# EAGLE design core1 (EAGLE 6.6.0)

## Sheet 1 of 2
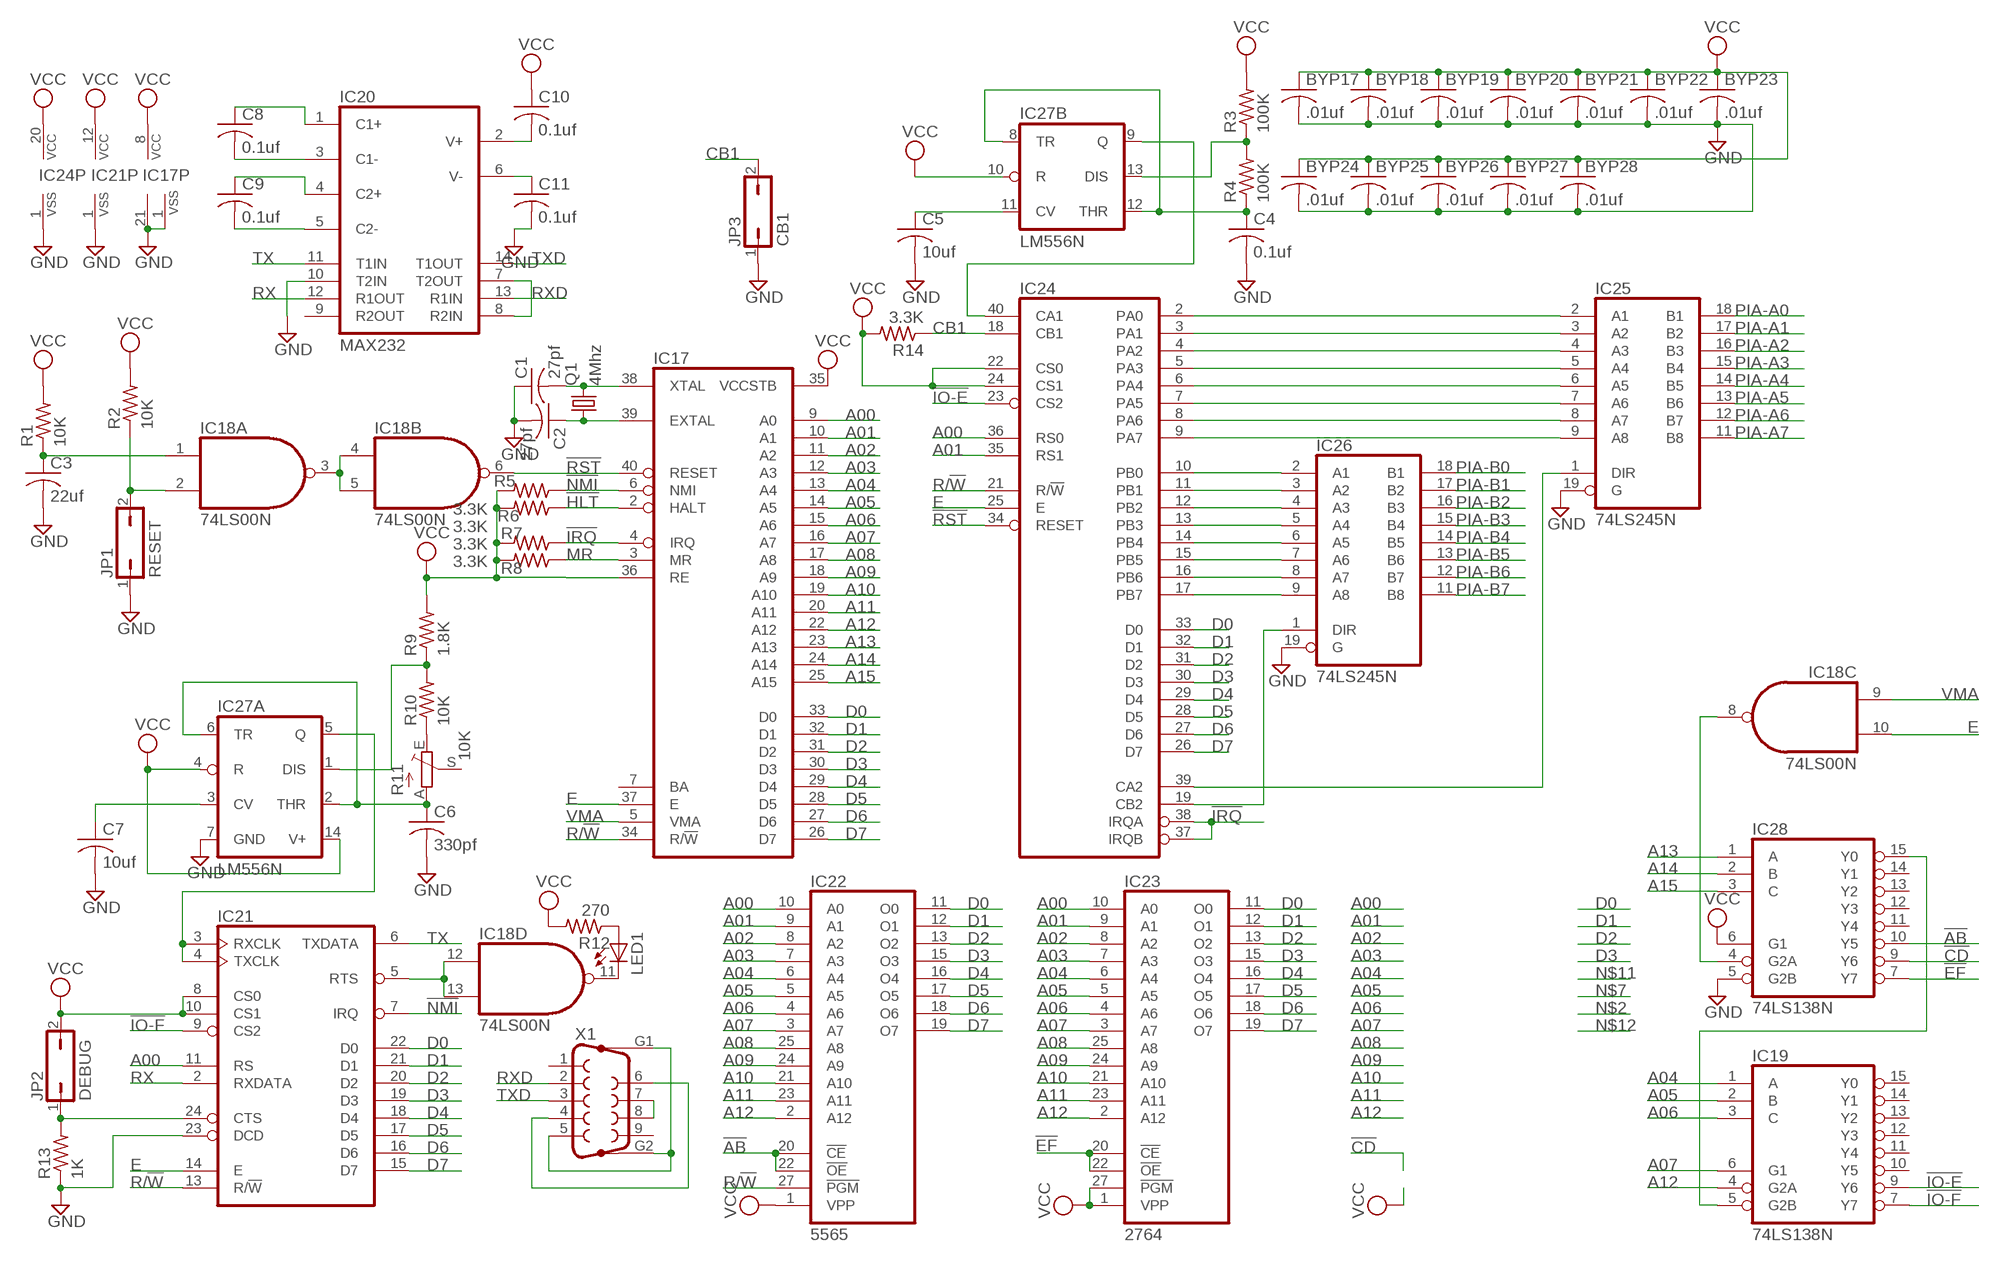
[diagram p0: schematic, sheet 1]

### Parts
BYP17  .01uf  C-US050-025X075  [C050-025X075]
BYP18  .01uf  C-US050-025X075  [C050-025X075]
BYP19  .01uf  C-US050-025X075  [C050-025X075]
BYP20  .01uf  C-US050-025X075  [C050-025X075]
BYP21  .01uf  C-US050-025X075  [C050-025X075]
BYP22  .01uf  C-US050-025X075  [C050-025X075]
BYP23  .01uf  C-US050-025X075  [C050-025X075]
BYP24  .01uf  C-US050-025X075  [C050-025X075]
BYP25  .01uf  C-US050-025X075  [C050-025X075]
BYP26  .01uf  C-US050-025X075  [C050-025X075]
BYP27  .01uf  C-US050-025X075  [C050-025X075]
BYP28  .01uf  C-US050-025X075  [C050-025X075]
C1  27pf  C-US050-025X075  [C050-025X075]
C2  27pf  C-US050-025X075  [C050-025X075]
C3  22uf  C-US102-043X133  [C102-043X133]
C4  0.1uf  C-US050-025X075  [C050-025X075]
C5  10uf  C-US050-025X075  [C050-025X075]
C6  330pf  C-US050-025X075  [C050-025X075]
C7  10uf  C-US050-025X075  [C050-025X075]
C8  0.1uf  C-US050-025X075  [C050-025X075]
C9  0.1uf  C-US050-025X075  [C050-025X075]
C10  0.1uf  C-US050-025X075  [C050-025X075]
C11  0.1uf  C-US050-025X075  [C050-025X075]
IC17  6802  [DIL40]
IC18  74LS00N  [DIL14]
IC19  74LS138N  [DIL16]
IC20  MAX232  [DIL16]
IC21  6850  [DIL24]
IC22  5565  2764  [DIL28]
IC23  2764  [DIL28]
IC24  6821  [DIL40]
IC25  74LS245N  [DIL20]
IC26  74LS245N  [DIL20]
IC27  LM556N  [DIL14]
IC28  74LS138N  [DIL16]
JP1  RESET  JP1Q  [JP1]
JP2  DEBUG  JP1Q  [JP1]
JP3  CB1  JP1Q  [JP1]
LED1  LED3MM  [LED3MM]
Q1  4Mhz  CRYSTALHC18U-V  [HC18U-V]
R1  10K  R-US_0207/7  [0207/7]
R2  10K  R-US_0207/7  [0207/7]
R3  100K  R-US_0207/7  [0207/7]
R4  100K  R-US_0207/7  [0207/7]
R5  3.3K  R-US_0207/7  [0207/7]
R6  3.3K  R-US_0207/7  [0207/7]
R7  3.3K  R-US_0207/7  [0207/7]
R8  3.3K  R-US_0207/7  [0207/7]
R9  1.8K  R-US_0207/7  [0207/7]
R10  10K  R-US_0207/7  [0207/7]
R11  10K  TRIM_EU-B90P  [SP19L]
R12  270  R-US_0207/7  [0207/7]
R13  1K  R-US_0207/7  [0207/7]
R14  3.3K  R-US_0207/7  [0207/7]
X1  F09HP  [F09HP]

### Nets
!AB: IC22.20(!CE) IC22.22(!OE) IC28.10(Y5)
!CD: IC28.9(Y6)
!EF: IC23.20(!CE) IC23.22(!OE) IC28.7(Y7)
!HLT: IC17.2(HALT) R5.1
!IO-E: IC19.9(Y6) IC24.23(CS2)
!IO-F: IC19.7(Y7) IC21.9(CS2)
!IRQ: IC17.4(IRQ) IC24.37(IRQB) IC24.38(IRQA) R7.1
!NMI: IC17.6(NMI) IC21.7(IRQ) R6.1
!RST: IC17.40(RESET) IC18.6(B:O) IC24.34(RESET)
A00: IC17.9(A0) IC21.11(RS) IC22.10(A0) IC23.10(A0) IC24.36(RS0)
A01: IC17.10(A1) IC22.9(A1) IC23.9(A1) IC24.35(RS1)
A02: IC17.11(A2) IC22.8(A2) IC23.8(A2)
A03: IC17.12(A3) IC22.7(A3) IC23.7(A3)
A04: IC17.13(A4) IC19.1(A) IC22.6(A4) IC23.6(A4)
A05: IC17.14(A5) IC19.2(B) IC22.5(A5) IC23.5(A5)
A06: IC17.15(A6) IC19.3(C) IC22.4(A6) IC23.4(A6)
A07: IC17.16(A7) IC19.6(G1) IC22.3(A7) IC23.3(A7)
A08: IC17.17(A8) IC22.25(A8) IC23.25(A8)
A09: IC17.18(A9) IC22.24(A9) IC23.24(A9)
A10: IC17.19(A10) IC22.21(A10) IC23.21(A10)
A11: IC17.20(A11) IC22.23(A11) IC23.23(A11)
A12: IC17.22(A12) IC19.4(G2A) IC22.2(A12) IC23.2(A12)
A13: IC17.23(A13) IC28.1(A)
A14: IC17.24(A14) IC28.2(B)
A15: IC17.25(A15) IC28.3(C)
CB1: IC24.18(CB1) JP3.2 R14.1
D0: IC17.33(D0) IC21.22(D0) IC22.11(O0) IC23.11(O0) IC24.33(D0)
D1: IC17.32(D1) IC21.21(D1) IC22.12(O1) IC23.12(O1) IC24.32(D1)
D2: IC17.31(D2) IC21.20(D2) IC22.13(O2) IC23.13(O2) IC24.31(D2)
D3: IC17.30(D3) IC21.19(D3) IC22.15(O3) IC23.15(O3) IC24.30(D3)
D4: IC17.29(D4) IC21.18(D4) IC22.16(O4) IC23.16(O4) IC24.29(D4)
D5: IC17.28(D5) IC21.17(D5) IC22.17(O5) IC23.17(O5) IC24.28(D5)
D6: IC17.27(D6) IC21.16(D6) IC22.18(O6) IC23.18(O6) IC24.27(D6)
D7: IC17.26(D7) IC21.15(D7) IC22.19(O7) IC23.19(O7) IC24.26(D7)
E: IC17.37(E) IC18.10(C:I1) IC21.14(E) IC24.25(E)
GND [Power]: BYP17.2 BYP18.2 BYP19.2 BYP20.2 BYP21.2 BYP22.2 BYP23.2 BYP24.2 BYP25.2 BYP26.2 BYP27.2 BYP28.2 C1.1 C2.2 C3.2 C4.2 C5.2 C6.2 C7.2 C11.2 IC17.1(VSS) IC17.21(VSS) IC20.10(T2IN) IC21.1(VSS) IC21.23(DCD) IC24.1(VSS) IC25.19(G) IC26.19(G) IC27.7(A:GND) IC28.5(G2B) JP1.1 JP3.1 R13.1 ; also sheet 2
MR: IC17.3(MR) R8.1
N$3: C2.1 IC17.39(EXTAL) Q1.1
N$4: C1.2 IC17.38(XTAL) Q1.2
N$5: IC24.2(PA0) IC25.2(A1)
N$6: IC18.3(A:O) IC18.4(B:I0) IC18.5(B:I1)
N$21: C3.1 IC18.1(A:I0) R1.1
N$22: IC18.2(A:I1) JP1.2 R2.1
N$23: IC21.3(RXCLK) IC21.4(TXCLK) IC27.5(A:Q)
N$24: IC24.10(PB0) IC26.2(A1)
N$25: IC24.11(PB1) IC26.3(A2)
N$27: C6.1 IC27.2(A:THR) IC27.6(A:TR) R11.A
N$28: IC27.1(A:DIS) R9.1 R10.2
N$94: IC24.12(PB2) IC26.4(A3)
N$124: IC24.13(PB3) IC26.5(A4)
N$125: IC24.14(PB4) IC26.6(A5)
N$126: IC24.15(PB5) IC26.7(A6)
N$127: IC24.16(PB6) IC26.8(A7)
N$128: IC24.17(PB7) IC26.9(A8)
N$129: IC24.3(PA1) IC25.3(A2)
N$130: IC24.4(PA2) IC25.4(A3)
N$131: IC24.5(PA3) IC25.5(A4)
N$132: IC24.6(PA4) IC25.6(A5)
N$133: IC24.7(PA5) IC25.7(A6)
N$134: IC24.8(PA6) IC25.8(A7)
N$135: IC24.9(PA7) IC25.9(A8)
N$136: IC24.19(CB2) IC26.1(DIR)
N$137: IC24.39(CA2) IC25.1(DIR)
N$138: IC24.40(CA1) IC27.9(B:Q)
N$140: C4.1 IC27.8(B:TR) IC27.12(B:THR) R4.1
N$141: IC27.13(B:DIS) R3.1 R4.2
N$142: C5.1 IC27.11(B:CV)
N$143: R10.1 R11.E
N$144: X1.4 X1.6
N$145: X1.7 X1.8
N$146: X1.5 X1.G1 X1.G2
N$147: IC18.12(D:I0) IC18.13(D:I1) IC21.5(RTS)
N$148: IC18.11(D:O) LED1.K(C)
N$149: LED1.A R12.1
N$150: IC21.24(CTS) JP2.1 R13.2
N$151: IC18.8(C:O) IC28.4(G2A)
N$152: IC19.5(G2B) IC28.15(Y0)
N$153: IC20.7(T2OUT) IC20.8(R2IN)
N$154: C7.1 IC27.3(A:CV)
N$155: C9.2 IC20.5(C2-)
N$156: C9.1 IC20.4(C2+)
N$157: C8.2 IC20.3(C1-)
N$158: C8.1 IC20.1(C1+)
N$159: C11.1 IC20.6(V-)
N$160: C10.2 IC20.2(V+)
PIA-A0: IC25.18(B1) ; also sheet 2
PIA-A1: IC25.17(B2) ; also sheet 2
PIA-A2: IC25.16(B3) ; also sheet 2
PIA-A3: IC25.15(B4) ; also sheet 2
PIA-A4: IC25.14(B5) ; also sheet 2
PIA-A5: IC25.13(B6) ; also sheet 2
PIA-A6: IC25.12(B7) ; also sheet 2
PIA-A7: IC25.11(B8) ; also sheet 2
PIA-B0: IC26.18(B1) ; also sheet 2
PIA-B1: IC26.17(B2) ; also sheet 2
PIA-B2: IC26.16(B3) ; also sheet 2
PIA-B3: IC26.15(B4) ; also sheet 2
PIA-B4: IC26.14(B5) ; also sheet 2
PIA-B5: IC26.13(B6) ; also sheet 2
PIA-B6: IC26.12(B7) ; also sheet 2
PIA-B7: IC26.11(B8) ; also sheet 2
R/!W: IC17.34(R/!W) IC21.13(R/!W) IC22.27(!PGM) IC24.21(R/!W)
RX: IC20.12(R1OUT) IC21.2(RXDATA)
RXD: IC20.13(R1IN) X1.2
TX: IC20.11(T1IN) IC21.6(TXDATA)
TXD: IC20.14(T1OUT) X1.3
VCC [Power]: BYP17.1 BYP18.1 BYP19.1 BYP20.1 BYP21.1 BYP22.1 BYP23.1 BYP24.1 BYP25.1 BYP26.1 BYP27.1 BYP28.1 C10.1 IC17.8(VCC) IC17.35(VCCSTB) IC17.36(RE) IC21.8(CS0) IC21.10(CS1) IC21.12(VCC) IC22.1(VPP) IC23.1(VPP) IC23.27(!PGM) IC24.20(VCC) IC24.22(CS0) IC24.24(CS1) IC27.4(A:R) IC27.10(B:R) IC27.14(A:V+) IC28.6(G1) JP2.2 R1.2 R2.2 R3.2 R5.2 R6.2 R7.2 R8.2 R9.2 R12.2 R14.2 ; also sheet 2
VMA: IC17.5(VMA) IC18.9(C:I0)
Unconnected: IC17.7(BA) IC19.10(Y5) IC19.11(Y4) IC19.12(Y3) IC19.13(Y2) IC19.14(Y1) IC19.15(Y0) IC20.9(R2OUT) IC28.11(Y4) IC28.12(Y3) IC28.13(Y2) IC28.14(Y1) R11.S X1.1 X1.9

## Sheet 2 of 2
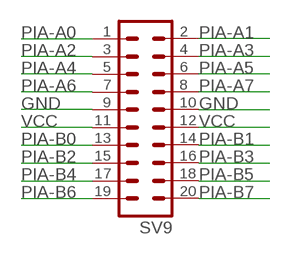
[diagram p1: schematic, sheet 2]

### Parts
SV9  MA10-2  [MA10-2]

### Nets
GND [Power]: SV9.9 SV9.10 ; also sheet 1
PIA-A0: SV9.1 ; also sheet 1
PIA-A1: SV9.2 ; also sheet 1
PIA-A2: SV9.3 ; also sheet 1
PIA-A3: SV9.4 ; also sheet 1
PIA-A4: SV9.5 ; also sheet 1
PIA-A5: SV9.6 ; also sheet 1
PIA-A6: SV9.7 ; also sheet 1
PIA-A7: SV9.8 ; also sheet 1
PIA-B0: SV9.13 ; also sheet 1
PIA-B1: SV9.14 ; also sheet 1
PIA-B2: SV9.15 ; also sheet 1
PIA-B3: SV9.16 ; also sheet 1
PIA-B4: SV9.17 ; also sheet 1
PIA-B5: SV9.18 ; also sheet 1
PIA-B6: SV9.19 ; also sheet 1
PIA-B7: SV9.20 ; also sheet 1
VCC [Power]: SV9.11 SV9.12 ; also sheet 1

## Power pins joined to a net without a drawn wire
GND: IC18.7(P:GND) IC19.8(GND) IC20.15(GND) IC22.14(GND) IC23.14(GND) IC25.10(GND) IC26.10(GND) IC28.8(GND)
VCC: IC18.14(P:VCC) IC19.16(VCC) IC20.16(VCC) IC22.28(VCC) IC23.28(VCC) IC25.20(VCC) IC26.20(VCC) IC28.16(VCC)

## Library data of the parts
BYP17-BYP28 C1-C11 = rcl:C-US: CAPACITOR, American symbol
IC17 = micro-motorola:6802: MICROCONTROLLER/MEMORY DEVICE; OC_FARNELL: unknown; OC_NEWARK: unknown
IC18 = 74xx-us:74*00: Quad 2-input NAND gate
IC19 IC28 = 74xx-us:74*138: 3-line to 8-line DECODER/DEMULTIPLEXER
IC20 = maxim:MAX232: RS232 TRANSCEIVER; MF: MAXIM; MPN: MAX232ACPE+; OC_FARNELL: 9723773; OC_NEWARK: 68K4544
IC21 = micro-motorola:6850: MICROCONTROLLER/MEMORY DEVICE; MF: NTE ELECTRONICS; MPN: NTE6850; OC_FARNELL: 4899775; OC_NEWARK: 31C2457
IC22 IC23 = memory:2764: MEMORY
IC24 = micro-motorola:6821: MICROCONTROLLER/MEMORY DEVICE; MF: NTE ELECTRONICS; MPN: NTE6821; OC_FARNELL: 1652403; OC_NEWARK: 29C4772
IC25 IC26 = 74xx-us:74*245: Octal BUS TRANSCEIVER, 3-state
IC27 = linear:*556: Dual TIMER
JP1-JP3 = jumper:JP1Q: JUMPER
LED1 = led:LED: LED OSRAM: - CHIPLED LG R971, LG N971, LY N971, LG Q971, LY Q971, LO R971, LY R971 LH N974, LH R974 LS Q976, LO Q976, LY Q976 LO Q996 - Hyper CHIPLED LW Q18S LB Q993, LB Q99A, LB R99A - SideLED LS A670, LO A670, LY A670, LG A670, LP A670 LB A673, LV A673, LT A673, LW A673 LH A674 LY A675 LS A676, LA A676, LO A676, LY A676, LW A676 LS A679, LY A679, LG A679 - Hyper Micro SIDELED® LS Y876, LA Y876, LO Y876, LY Y876 LT Y87S - SmartLED LW L88C, LW L88S LB L89C, LB L89S, LG L890 LS L89K, LO L89K, LY L89K LS L896, LA L896, LO L896, LY L896 - TOPLED LS T670, LO T670, LY T670, LG T670, LP T670 LSG T670, LSP T670, LSY T670, LOP T670, LYG T670 LG T671, LOG T671, LSG T671 LB T673, LV T673, LT T673, LW T673 LH T674 LS T676, LA T676, LO T676, LY T676, LB T676, LH T676, LSB T676, LW T676 LB T67C, LV T67C, LT T67C, LS T67K, LO T67K, LY T67K, LW E67C LS E67B, LA E67B, LO E67B, LY E67B, LB E67C, LV E67C, LT E67C LW T67C LS T679, LY T679, LG T679 LS T770, LO T770, LY T770, LG T770, LP T770 LB T773, LV T773, LT T773, LW T773 LH T774 LS E675, LA E675, LY E675, LS T675 LS T776, LA T776, LO T776, LY T776, LB T776 LHGB T686 LT T68C, LB T68C - Hyper Mini TOPLED® LB M676 - Mini TOPLED Santana® LG M470 LS M47K, LO M47K, LY M47K Source: http://www.osram.convergy.de LUXEON: - LUMILED® LXK2-PW12-R00, LXK2-PW12-S00, LXK2-PW14-U00, LXK2-PW14-V00 LXK2-PM12-R00, LXK2-PM12-S00, LXK2-PM14-U00 LXK2-PE12-Q00, LXK2-PE12-R00, LXK2-PE12-S00, LXK2-PE14-T00, LXK2-PE14-U00 LXK2-PB12-K00, LXK2-PB12-L00, LXK2-PB12-M00, LXK2-PB14-N00, LXK2-PB14-P00, LXK2-PB14-Q00 LXK2-PR12-L00, LXK2-PR12-M00, LXK2-PR14-Q00, LXK2-PR14-R00 LXK2-PD12-Q00, LXK2-PD12-R00, LXK2-PD12-S00 LXK2-PH12-R00, LXK2-PH12-S00 LXK2-PL12-P00, LXK2-PL12-Q00, LXK2-PL12-R00 Source: www.luxeon.com KINGBRIGHT: KA-3528ASYC Source: www.kingbright.com
Q1 = crystal:CRYSTAL: CRYSTAL; OC_FARNELL: unknown; OC_NEWARK: unknown
R1-R10 R12-R14 = rcl:R-US_: RESISTOR, American symbol
R11 = pot:TRIM_EU-: POTENTIOMETER
SV9 = con-lstb:MA10-2: PIN HEADER; OC_FARNELL: unknown; OC_NEWARK: unknown
X1 = con-subd:F09HP: SUB-D; OC_FARNELL: unknown; OC_NEWARK: unknown

## Net classes
1 Power: width 0.508 mm, drill 0.254 mm, clearance 0.254 mm

## Board
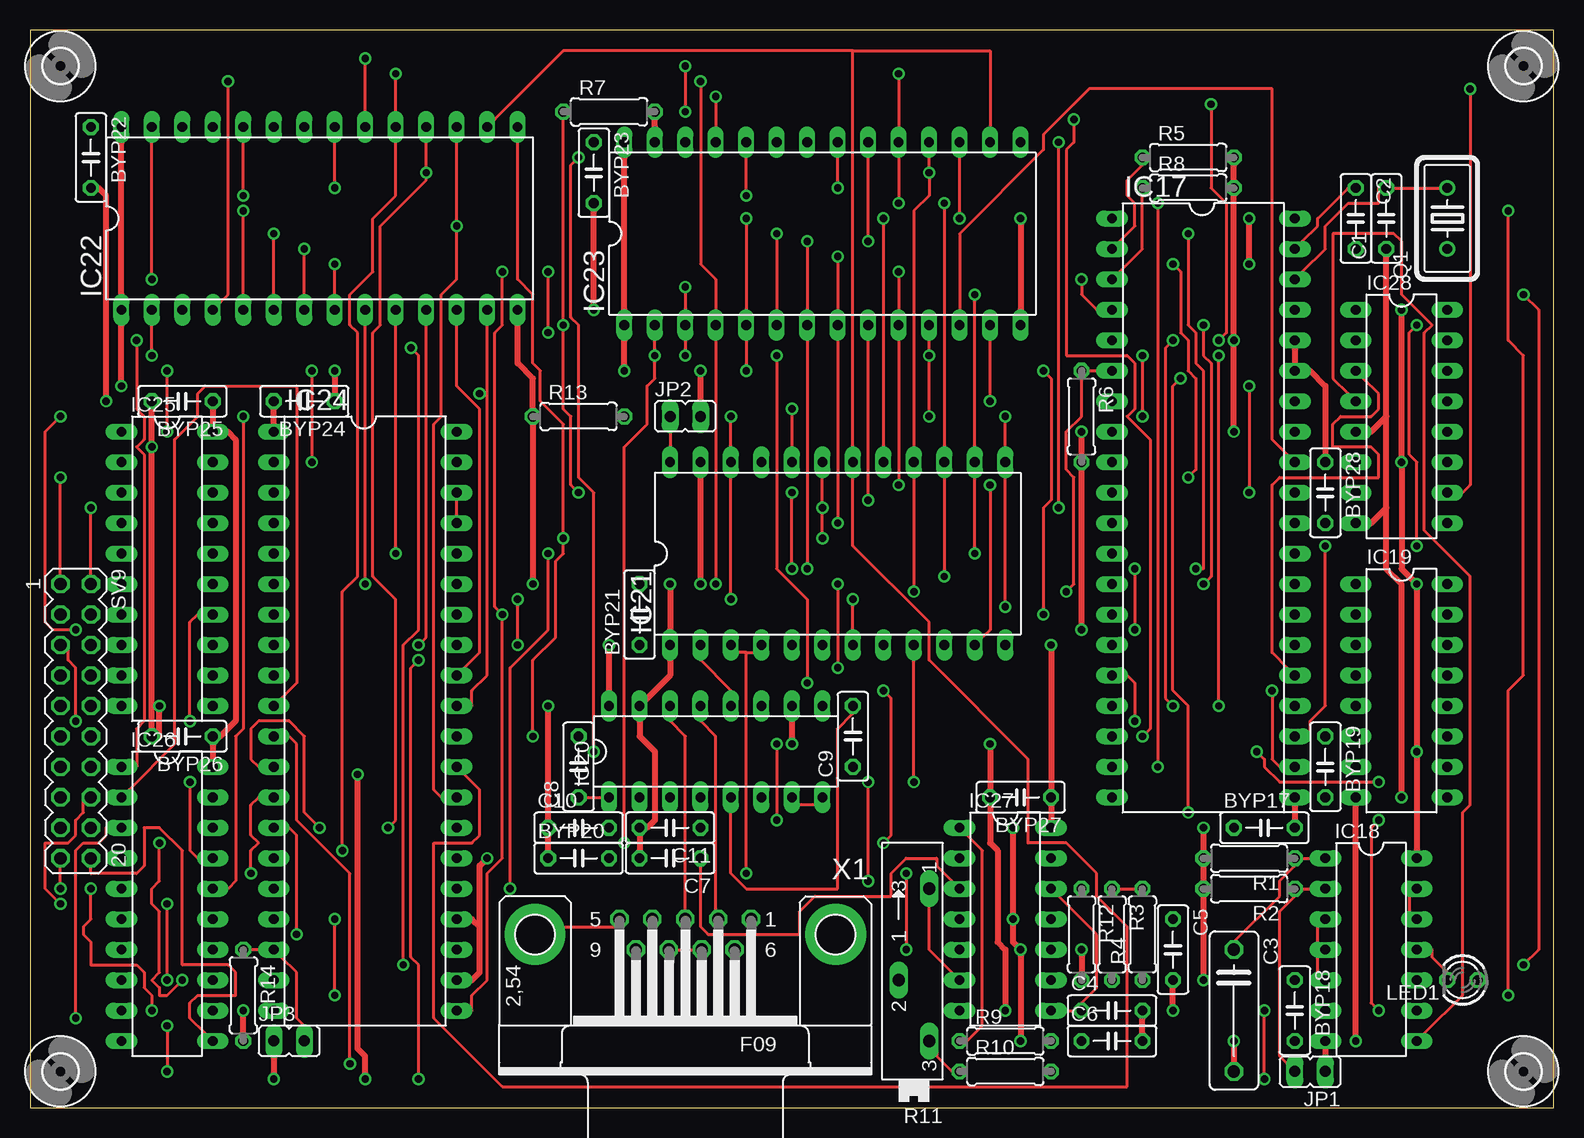
[diagram p2: board, top side]
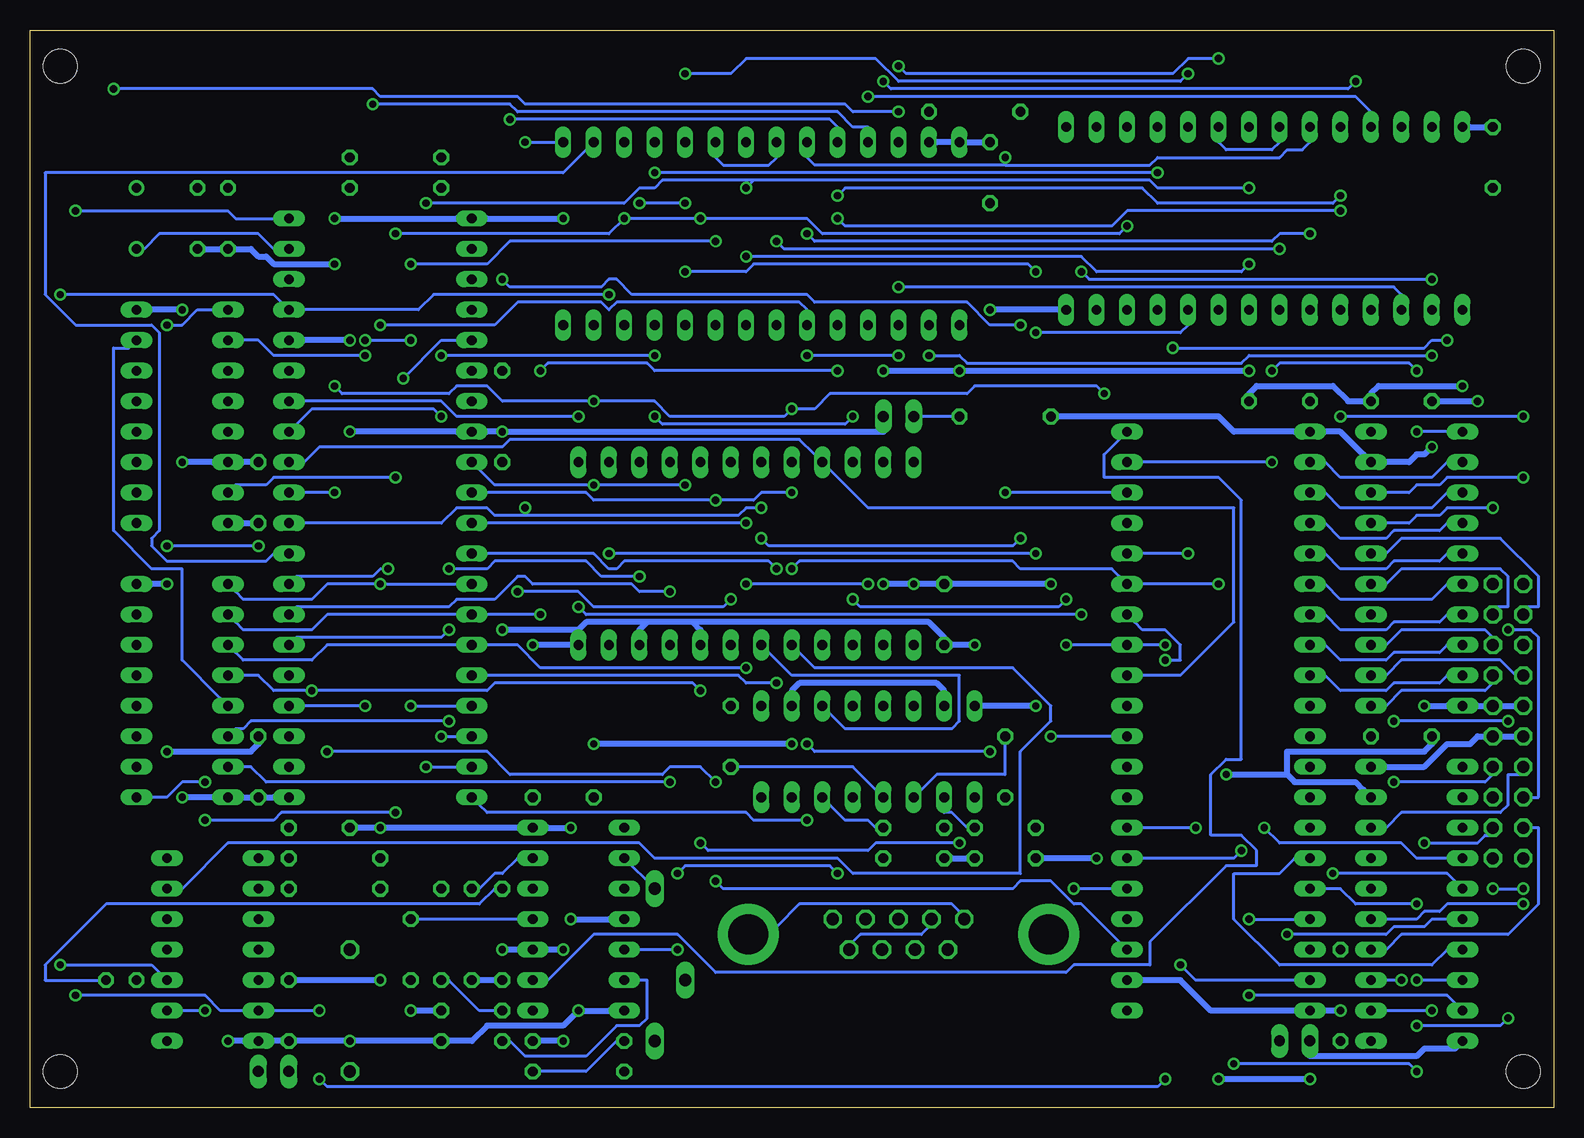
[diagram p3: board, bottom side, seen from below]

Size 126.98 x 89.84 mm. Coordinates in mm from the lower left corner, seen from the top.
Outline: 0,0 126.98,0 126.98,89.84 0,89.84 0,0
Copper layers (1*16): Top 0.035mm / dielectric 1.5mm / Bottom 0.035mm
Design rules "default": minimum track width 10mil, minimum drill 24mil, track to track 8mil, track to pad 8mil, pad to pad 8mil, via to via 8mil, smd to smd 8mil, copper to edge 40mil, drill to drill 8mil, minimum pad ring 10mil, minimum via ring 8mil, stop-mask expansion 4mil, vias tented up to drill 0mil, thermal gap 10mil

### Footprints (pad centres in the part's own frame; a part is rotated, then mirrored left to right if it is on the bottom)
C050-025X075 = drill 0.813 octagon: 1 -2.54,0; 2 2.54,0
C102-043X133 = drill 1.016 octagon: 1 -5.08,0; 2 5.08,0
DIL40 = drill 0.813 long: 1 -24.13,-7.62; 2 -21.59,-7.62; 3 -19.05,-7.62; 4 -16.51,-7.62; 5 -13.97,-7.62; 6 -11.43,-7.62; 7 -8.89,-7.62; 8 -6.35,-7.62; 9 -3.81,-7.62; 10 -1.27,-7.62; 11 1.27,-7.62; 12 3.81,-7.62; 13 6.35,-7.62; 14 8.89,-7.62; 15 11.43,-7.62; 16 13.97,-7.62; 17 16.51,-7.62; 18 19.05,-7.62; 19 21.59,-7.62; 20 24.13,-7.62; 21 24.13,7.62; 22 21.59,7.62; 23 19.05,7.62; 24 16.51,7.62; 25 13.97,7.62; 26 11.43,7.62; 27 8.89,7.62; 28 6.35,7.62; 29 3.81,7.62; 30 1.27,7.62; 31 -1.27,7.62; 32 -3.81,7.62; 33 -6.35,7.62; 34 -8.89,7.62; 35 -11.43,7.62; 36 -13.97,7.62; 37 -16.51,7.62; 38 -19.05,7.62; 39 -21.59,7.62; 40 -24.13,7.62
DIL14 = drill 0.813 long: 1 -7.62,-3.81; 2 -5.08,-3.81; 3 -2.54,-3.81; 4 0,-3.81; 5 2.54,-3.81; 6 5.08,-3.81; 7 7.62,-3.81; 8 7.62,3.81; 9 5.08,3.81; 10 2.54,3.81; 11 0,3.81; 12 -2.54,3.81; 13 -5.08,3.81; 14 -7.62,3.81
DIL16 = drill 0.813 long: 1 -8.89,-3.81; 2 -6.35,-3.81; 3 -3.81,-3.81; 4 -1.27,-3.81; 5 1.27,-3.81; 6 3.81,-3.81; 7 6.35,-3.81; 8 8.89,-3.81; 9 8.89,3.81; 10 6.35,3.81; 11 3.81,3.81; 12 1.27,3.81; 13 -1.27,3.81; 14 -3.81,3.81; 15 -6.35,3.81; 16 -8.89,3.81
DIL24 = drill 0.813 long: 1 -13.97,-7.62; 2 -11.43,-7.62; 3 -8.89,-7.62; 4 -6.35,-7.62; 5 -3.81,-7.62; 6 -1.27,-7.62; 7 1.27,-7.62; 8 3.81,-7.62; 9 6.35,-7.62; 10 8.89,-7.62; 11 11.43,-7.62; 12 13.97,-7.62; 13 13.97,7.62; 14 11.43,7.62; 15 8.89,7.62; 16 6.35,7.62; 17 3.81,7.62; 18 1.27,7.62; 19 -1.27,7.62; 20 -3.81,7.62; 21 -6.35,7.62; 22 -8.89,7.62; 23 -11.43,7.62; 24 -13.97,7.62
DIL28 = drill 0.813 long: 1 -16.51,-7.62; 2 -13.97,-7.62; 3 -11.43,-7.62; 4 -8.89,-7.62; 5 -6.35,-7.62; 6 -3.81,-7.62; 7 -1.27,-7.62; 8 1.27,-7.62; 9 3.81,-7.62; 10 6.35,-7.62; 11 8.89,-7.62; 12 11.43,-7.62; 13 13.97,-7.62; 14 16.51,-7.62; 15 16.51,7.62; 16 13.97,7.62; 17 11.43,7.62; 18 8.89,7.62; 19 6.35,7.62; 20 3.81,7.62; 21 1.27,7.62; 22 -1.27,7.62; 23 -3.81,7.62; 24 -6.35,7.62; 25 -8.89,7.62; 26 -11.43,7.62; 27 -13.97,7.62; 28 -16.51,7.62
DIL20 = drill 0.813 long: 1 -11.43,-3.81; 2 -8.89,-3.81; 3 -6.35,-3.81; 4 -3.81,-3.81; 5 -1.27,-3.81; 6 1.27,-3.81; 7 3.81,-3.81; 8 6.35,-3.81; 9 8.89,-3.81; 10 11.43,-3.81; 11 11.43,3.81; 12 8.89,3.81; 13 6.35,3.81; 14 3.81,3.81; 15 1.27,3.81; 16 -1.27,3.81; 17 -3.81,3.81; 18 -6.35,3.81; 19 -8.89,3.81; 20 -11.43,3.81
JP1 = drill 0.914 long: 1 0,-1.27; 2 0,1.27
LED3MM = drill 0.813 octagon: A -1.27,0; K 1.27,0
HC18U-V = drill 0.813: 1 -2.54,0; 2 2.54,0
0207/7 = drill 0.813 octagon: 1 -3.81,0; 2 3.81,0
SP19L = drill 1.016 long: A 5.715,-1.27; E -6.985,-1.27; S -1.905,1.27
MA10-2 = drill 1.016 octagon: 1 -11.43,-1.27; 2 -11.43,1.27; 3 -8.89,-1.27; 4 -8.89,1.27; 5 -6.35,-1.27; 6 -6.35,1.27; 7 -3.81,-1.27; 8 -3.81,1.27; 9 -1.27,-1.27; 10 -1.27,1.27; 11 1.27,-1.27; 12 1.27,1.27; 13 3.81,-1.27; 14 3.81,1.27; 15 6.35,-1.27; 16 6.35,1.27; 17 8.89,-1.27; 18 8.89,1.27; 19 11.43,-1.27; 20 11.43,1.27
2,8 = hole 2.8: 0,0
F09HP = drill 1.016 octagon: 1 -5.486,-1.27; 2 -2.743,-1.27; 3 0,-1.27; 4 2.743,-1.27; 5 5.486,-1.27; 6 -4.115,1.27; 7 -1.372,1.27; 8 1.372,1.27; 9 4.115,1.27 | drill 3.302 pad 5.08: G1 -12.522,0; G2 12.522,0

### Placement (x,y rotation side)
BYP17  102.87,23.33 0 top
BYP18  105.41,8.09 270 top
BYP19  107.95,28.41 270 top
BYP20  45.71,20.79 0 top
BYP21  50.79,41.11 90 top
BYP22  5.08,79.21 270 top
BYP23  46.98,77.94 270 top
BYP24  22.86,58.89 180 top
BYP25  12.69,58.89 180 top
BYP26  12.69,30.95 180 top
BYP27  82.55,25.87 180 top
BYP28  107.95,51.27 270 top
C1  113.03,74.13 90 top
C2  110.48,74.13 270 top
C3  100.33,8.09 270 top
C4  90.17,8.09 0 top
C5  95.25,13.17 270 top
C6  90.17,5.55 0 top
C7  53.34,20.79 180 top
C8  45.71,28.41 90 top
C9  68.58,30.95 90 top
C10  45.71,23.33 0 top
C11  53.34,23.33 180 top
IC17  97.79,50 270 top
IC18  111.76,13.17 270 top
IC19  114.3,34.76 270 top
IC20  57.14,29.68 0 top
IC21  67.31,46.19 0 top
IC22  24.12,74.13 0 top
IC23  66.04,72.86 0 top
IC24  27.94,32.22 270 top
IC25  11.42,44.92 270 top
IC26  11.42,16.98 270 top
IC27  81.28,15.71 270 top
IC28  114.3,57.62 270 top
JP1  106.68,3.01 90 top
JP2  54.6,57.62 270 top
JP3  21.59,5.55 270 top
LED1  119.38,10.63 180 top
Q1  118.11,74.13 90 top
R1  101.59,20.79 180 top
R2  101.59,18.25 180 top
R3  90.17,14.44 270 top
R4  92.7,14.44 90 top
R5  96.52,79.21 0 top
R6  87.62,57.62 270 top
R7  48.25,83.02 0 top
R8  96.52,76.67 0 top
R9  81.28,5.55 0 top
R10  81.28,3.01 0 top
R11  73.66,12.54 90 top
R12  87.62,14.44 270 top
R13  45.71,57.62 0 top
R14  17.78,9.36 270 top
SV9  3.81,32.22 270 top
U$3  [2,8]  2.54,86.83 0 top
U$4  [2,8]  2.54,3.01 0 top
U$5  [2,8]  124.45,86.83 0 top
U$6  [2,8]  124.45,3.01 0 top
X1  54.6,14.44 180 top

### Tracks (layer width: path | path; a pad name or v marks a point on that pad's centre or on a via)
!AB  (via drill 0.61)
  Top 0.254: v120.01,84.92 120.01,51.91 119.38,51.27 IC28.10 | v54.6,86.83 v54.6,83.02 | v27.94,87.47 27.94,83.02 IC22.20
  Bottom 0.254: IC22.20 27.94,80.48 27.3,79.84 23.49,79.84 22.86,80.48 IC22.22 | v120.01,84.92 98.42,84.92 97.79,84.29 86.36,84.29 85.72,83.66 59.05,83.66 58.41,83.02 v54.6,83.02 | v54.6,86.83 53.97,86.19 31.75,86.19 30.48,87.47 v27.94,87.47
!EF  (via drill 0.61)
  Top 0.254: v96.52,52.54 97.15,53.17 97.15,60.8 96.52,61.43 96.52,63.97 95.88,64.61 95.88,69.69 v95.25,70.32 | v69.84,72.22 69.84,79.21 IC23.20
  Bottom 0.254: IC23.20 69.84,79.21 69.21,78.58 65.4,78.58 64.77,79.21 IC23.22 | v96.52,52.54 106.68,52.54 107.31,51.91 109.85,51.91 IC28.7 | v95.25,70.32 88.9,70.32 86.99,72.22 v69.84,72.22
!HLT
  Top 0.254: IC17.2 90.8,72.22 92.07,73.5 92.07,75.4 91.44,76.03 91.44,77.3 92.7,78.58 R5.1
!IO-E  (via drill 0.61)
  Top 0.254: v69.84,18.88 v69.84,27.14 | v102.23,29.68 102.87,29.04 102.87,28.41 104.14,27.14 v112.39,27.14
  Bottom 0.254: v69.84,18.88 69.21,18.25 45.08,18.25 44.45,18.88 41.9,18.88 40,16.98 39.36,16.98 36.19,13.81 IC24.23 | v69.84,27.14 71.12,28.41 73.66,28.41 74.29,27.77 86.99,27.77 88.9,29.68 v102.23,29.68 | v112.39,27.14 114.3,27.14 115.56,25.87 116.84,25.87 IC19.9
!IO-F  (via drill 0.61)
  Top 0.254: v73.66,27.14 73.66,37.3 IC21.9
  Bottom 0.254: v73.66,27.14 107.31,27.14 108.58,28.41 109.22,28.41 IC19.7
!IRQ  (via drill 0.61)
  Top 0.254: IC24.38 35.55,50.63 35.55,49.37 IC24.37 | v45.71,51.27 45.08,51.91 45.08,57.62 44.45,58.25 v44.45,65.24 44.45,82.39 R7.1 | v87.62,69.05 87.62,67.78 88.9,66.51 IC17.4
  Bottom 0.254: v45.71,51.27 36.82,51.27 IC24.38 | v87.62,69.05 86.99,68.41 79.37,68.41 78.73,69.05 78.1,69.05 76.83,67.78 62.22,67.78 61.59,67.14 48.89,67.14 46.98,65.24 v44.45,65.24
!NMI  (via drill 0.61)
  Top 0.254: IC17.6 88.9,61.43 88.26,61.43 R6.1 87.62,60.8 87.62,57.62 86.36,56.35 86.36,53.17 86.99,52.54 86.99,43.65 v86.36,43.02 | v68.58,42.38 68.58,39.84 IC21.7
  Bottom 0.254: v68.58,42.38 69.21,41.74 80.01,41.74 81.28,43.02 v86.36,43.02
!RST  (via drill 0.61)
  Top 0.254: v32.38,37.3 31.75,36.66 31.75,12.54 32.38,11.9 v32.38,2.38 | v102.87,2.38 v102.87,8.09 | v123.19,74.77 123.19,63.97 124.45,62.7 124.45,36.03 123.19,34.76 v123.19,9.36
  Bottom 0.254: v32.38,37.3 31.11,37.3 31.11,38.57 32.38,39.84 34.28,39.84 34.92,40.48 IC24.34 | v32.38,2.38 33.02,1.74 102.23,1.74 v102.87,2.38 | v102.87,8.09 106.68,8.09 IC18.6 109.22,8.09 111.12,8.09 112.39,9.36 v123.19,9.36 | v123.19,74.77 110.48,74.77 109.85,74.13 106.68,74.13 IC17.40
A00  (via drill 0.61)
  Top 0.254: v30.48,46.19 30.48,65.24 IC22.10 | v80.01,51.91 80.01,39.84 79.37,39.2 IC21.11 | v72.39,51.91 72.39,63.97 IC23.10 72.39,66.51 v72.39,69.69 | v43.17,64.61 v43.17,69.69
  Bottom 0.254: v30.48,46.19 34.28,46.19 IC24.36 | IC17.9 89.53,53.17 88.26,51.91 v80.01,51.91 v72.39,51.91 | v43.17,64.61 31.11,64.61 30.48,65.24 IC22.10 | v43.17,69.69 43.81,70.32 66.67,70.32 67.31,69.69 v72.39,69.69
A01  (via drill 0.61)
  Top 0.254: v27.94,43.65 27.94,65.24 IC22.9 | v69.84,50.63 69.84,63.97 IC23.9 | v63.49,44.92 v63.49,51.27
  Bottom 0.254: v27.94,43.65 34.28,43.65 IC24.35 36.19,44.28 36.82,44.92 44.45,44.92 45.08,45.55 62.86,45.55 v63.49,44.92 | IC17.10 88.9,51.27 80.64,51.27 80.01,50.63 v69.84,50.63 66.67,50.63 66.04,51.27 v63.49,51.27
A02  (via drill 0.61)
  Top 0.254: v25.39,70.32 25.39,67.78 IC22.8 | v67.31,70.95 67.31,66.51 IC23.8 67.31,63.97 v67.31,48.73
  Bottom 0.254: v25.39,70.32 26.03,69.69 38.09,69.69 39.36,70.95 v67.31,70.95 | v67.31,48.73 88.9,48.73 IC17.11
A03  (via drill 0.61)
  Top 0.254: v22.86,71.59 22.86,67.78 IC22.7 | v64.77,72.22 64.77,66.51 IC23.7 64.77,63.97 v64.77,44.92
  Bottom 0.254: v22.86,71.59 64.13,71.59 v64.77,72.22 | v64.77,44.92 65.4,45.55 77.47,45.55 78.1,44.92 78.73,44.92 80.01,46.19 88.9,46.19 IC17.12
A04  (via drill 0.61)
  Top 0.254: v20.32,72.86 20.32,67.78 IC22.6 | v62.22,72.86 62.22,66.51 IC23.6 | v97.79,43.65 98.42,44.28 98.42,62.06 97.79,62.7 v97.79,65.24
  Bottom 0.254: IC19.1 109.85,43.02 109.22,42.38 103.5,42.38 102.23,43.65 v97.79,43.65 91.44,43.65 IC17.13 | v20.32,72.86 22.86,72.86 23.49,72.22 61.59,72.22 v62.22,72.86 | v97.79,65.24 88.26,65.24 86.36,67.14 79.37,67.14 78.73,66.51 78.1,67.14 62.86,67.14 62.22,66.51 IC23.6
A05  (via drill 0.61)
  Top 0.254: v17.78,74.77 17.78,67.78 IC22.5 | v59.68,74.13 59.68,66.51 IC23.5 59.68,63.97 v59.68,61.43 | v84.45,41.11 84.45,50 85.09,50.63 85.09,60.8 v84.45,61.43
  Bottom 0.254: IC19.2 109.85,40.48 109.22,39.84 103.5,39.84 102.23,41.11 91.44,41.11 IC17.14 88.9,41.11 v84.45,41.11 | v17.78,74.77 35.55,74.77 36.82,73.5 59.05,73.5 v59.68,74.13 | v84.45,61.43 83.81,62.06 75.56,62.06 74.93,61.43 v59.68,61.43
A06  (via drill 0.61)
  Top 0.254: v16.51,85.56 16.51,67.78 15.87,67.14 IC22.4 | v55.88,85.56 55.88,70.32 57.14,69.05 57.14,66.51 IC23.4 57.14,63.97 v57.14,43.65 | v67.31,43.65 v67.31,36.66
  Bottom 0.254: IC19.3 109.85,37.94 109.22,37.3 103.5,37.3 102.23,38.57 91.44,38.57 IC17.15 88.9,38.57 86.36,38.57 84.45,36.66 v67.31,36.66 | v16.51,85.56 17.14,84.92 55.24,84.92 v55.88,85.56 | v57.14,43.65 v67.31,43.65
A07  (via drill 0.61)
  Top 0.254: v92.07,32.22 92.07,35.39 91.44,36.03 IC17.16 | v54.6,68.41 54.6,66.51 IC23.3 54.6,63.97 v54.6,62.7 | v64.77,35.39 64.77,42.38 62.22,44.92 v62.22,62.7
  Bottom 0.254: v92.07,32.22 108.58,32.22 109.22,31.58 109.85,31.58 IC19.6 | v54.6,68.41 13.33,68.41 12.69,67.78 IC22.3 | v64.77,35.39 67.31,35.39 67.94,36.03 88.9,36.03 IC17.16 | v54.6,62.7 v62.22,62.7
A08  (via drill 0.61)
  Top 0.254: v57.14,84.29 57.14,81.75 IC23.25 | v95.25,33.49 94.61,34.12 94.61,63.34 v95.25,63.97 | v99.06,63.97 99.69,64.61 99.69,75.4 98.42,76.67 v98.42,83.66
  Bottom 0.254: v57.14,84.29 16.51,84.29 15.23,83.02 IC22.25 | v95.25,33.49 91.44,33.49 IC17.17 | v99.06,63.97 v95.25,63.97 | v98.42,83.66 86.99,83.66 86.36,83.02 59.68,83.02 58.41,81.75 57.14,81.75 IC23.25
A09  (via drill 0.61)
  Top 0.254: v17.78,76.03 17.78,80.48 IC22.24 | v59.68,76.03 59.68,79.21 IC23.24 | v92.7,30.95 93.34,31.58 93.34,55.71 91.44,57.62 92.07,58.25 92.07,62.06 91.44,62.7 86.36,62.7 86.36,79.84 86.99,80.48 v86.99,82.39
  Bottom 0.254: v17.78,76.03 18.41,75.4 33.02,75.4 34.28,76.67 59.05,76.67 v59.68,76.03 | v92.7,30.95 91.44,30.95 IC17.18 | v86.99,82.39 60.32,82.39 59.68,81.75 IC23.24
A10  (via drill 0.61)
  Top 0.254: v25.39,76.67 25.39,80.48 IC22.21 | v67.31,76.67 67.31,79.21 IC23.21 | v93.98,75.4 v93.98,28.41
  Bottom 0.254: v25.39,76.67 33.02,76.67 33.65,77.3 66.67,77.3 | 66.67,77.3 v67.31,76.67 | v93.98,28.41 91.44,28.41 IC17.19 | v93.98,75.4 77.47,75.4 76.2,76.67 74.93,76.67 74.29,77.3 66.67,77.3
A11  (via drill 0.61)
  Top 0.254: v62.22,30.31 v62.22,23.96 | v46.98,29.68 46.98,51.27 45.71,52.54 45.71,65.24 45.08,65.88 45.08,78.58 v45.71,79.21
  Bottom 0.254: 45.71,78.58 61.59,78.58 62.22,79.21 IC23.23 | 45.71,78.58 33.65,78.58 33.02,79.21 22.86,79.21 22.22,79.84 20.95,79.84 20.32,80.48 IC22.23 | v62.22,23.96 66.67,23.96 67.31,24.6 88.9,24.6 89.53,25.23 IC17.20 | v62.22,30.31 61.59,29.68 v46.98,29.68 | v45.71,79.21 45.71,78.58
A12  (via drill 0.61)
  Top 0.254: v103.5,34.76 103.5,29.04 104.14,28.41 IC17.22 | v10.15,62.7 10.15,65.24 IC22.2 | IC23.2 52.06,63.97 v52.06,62.7 52.06,60.8 51.43,60.16 51.43,56.98 49.52,55.08 v49.52,22.06 | v71.12,34.76 71.75,34.12 71.75,22.7 v71.12,22.06
  Bottom 0.254: IC19.4 109.22,36.03 107.95,36.03 106.68,34.76 v103.5,34.76 88.9,34.76 88.26,35.39 71.75,35.39 v71.12,34.76 | v10.15,62.7 25.39,62.7 26.03,62.06 48.89,62.06 49.52,62.7 v52.06,62.7 | v71.12,22.06 70.48,21.42 57.14,21.42 56.51,22.06 v49.52,22.06
A13  (via drill 0.61)
  Top 0.254: v107.95,46.82 107.95,33.49 106.68,32.22 106.68,30.95 IC17.23 | v115.56,46.82 115.56,53.81 114.93,54.45 114.93,64.61 v115.56,65.24
  Bottom 0.254: v107.95,46.82 v115.56,46.82 | v115.56,65.24 114.3,65.24 113.03,66.51 111.76,66.51 IC28.1
A14  (via drill 0.61)
  Top 0.254: v99.06,33.49 v99.06,62.7
  Bottom 0.254: v99.06,33.49 104.14,33.49 IC17.24 | v99.06,62.7 106.68,62.7 107.95,63.97 109.22,63.97 IC28.2
A15
  Top 0.254: IC17.25 104.77,36.66 103.5,37.94 103.5,51.91 104.14,52.54 112.39,52.54 112.39,54.45 111.76,55.08 108.58,55.08 108.58,56.98 109.22,57.62 111.76,57.62 112.39,58.25 112.39,59.52 111.12,60.8 IC28.3
CB1
  Top 0.254: R14.1 18.41,13.17 19.05,13.17 IC24.18 20.95,12.54 22.22,11.27 22.22,7.46 22.86,6.82 JP3.2
D0  (via drill 0.61)
  Top 0.254: v32.38,38.57 33.02,39.2 33.02,65.24 IC22.11 | v58.41,57.62 58.41,55.08 IC21.22 58.41,52.54 v58.41,42.38 | v74.93,57.62 v74.93,62.7 74.93,63.97 IC23.11 | v92.7,62.7 v92.7,57.62 | v40.63,38.57 v40.63,42.38
  Bottom 0.254: v32.38,38.57 34.28,38.57 IC24.33 36.82,38.57 v40.63,38.57 | v58.41,57.62 59.05,56.98 74.29,56.98 v74.93,57.62 | v92.7,57.62 93.34,58.25 103.5,58.25 104.77,56.98 IC17.33 | v74.93,62.7 v92.7,62.7 | v40.63,42.38 41.27,41.74 57.78,41.74 v58.41,42.38
D1
  Top 0.254: IC24.32 36.19,36.66 37.46,37.94 37.46,58.25 35.55,60.16 35.55,65.24 IC22.12 | IC23.12 77.47,66.51 77.47,72.86 84.45,79.84 84.45,81.11 88.26,84.92 103.5,84.92 103.5,55.71 104.77,54.45 IC17.32
  Bottom 0.254: IC17.32 104.14,53.81 102.87,55.08 87.62,55.08 86.99,55.71 62.86,55.71 61.59,54.45 IC21.21 60.32,53.17 57.14,50 26.67,50 26.67,40.48 31.11,36.03 34.28,36.03 IC24.32
D2  (via drill 0.61)
  Top 0.254: 38.09,59.52 38.09,65.24 IC22.13 | 38.09,59.52 38.09,36.03 36.82,34.76 36.82,33.49 IC24.31 | v63.49,58.25 63.49,55.08 IC21.20 | v80.01,58.89 80.01,63.97 IC23.13 | v101.59,60.16 v101.59,51.27 | 38.09,59.52 v37.46,59.52
  Bottom 0.254: v101.59,51.27 104.14,51.27 IC17.31 | v101.59,60.16 100.96,59.52 92.07,59.52 91.44,60.16 88.9,60.16 87.62,58.89 v80.01,58.89 74.93,58.89 73.66,57.62 64.13,57.62 v63.49,58.25 61.59,58.25 60.32,59.52 48.89,59.52 48.25,60.16 38.09,60.16 v37.46,59.52
D3  (via drill 0.61)
  Top 0.254: v41.9,30.95 41.9,37.3 43.81,39.2 43.81,45.55 44.45,46.19 v44.45,47.46 44.45,56.98 42.54,58.89 42.54,61.43 41.9,62.06 41.9,67.78 40.63,69.05 40.63,80.48 IC22.15 | v66.04,47.46 v66.04,50 66.04,52.54 IC21.19 | v85.72,50 v85.72,80.48
  Bottom 0.254: v41.9,30.95 36.82,30.95 IC24.30 | v44.45,47.46 45.08,46.82 65.4,46.82 v66.04,47.46 | 85.72,49.37 67.94,49.37 67.31,50 v66.04,50 | 85.72,49.37 88.26,49.37 88.9,50 91.44,50 92.7,48.73 104.14,48.73 IC17.30 | v85.72,80.48 83.18,80.48 IC23.15 | 85.72,49.37 v85.72,50
D4
  Top 0.254: IC24.29 36.19,27.77 37.46,26.5 37.46,22.7 36.82,22.06 33.65,22.06 33.65,7.46 39.36,1.74 91.44,1.74 91.44,15.08 88.9,17.61 88.9,19.52 86.36,22.06 83.18,22.06 83.18,29.04 74.93,37.3 74.93,40.48 68.58,46.82 68.58,52.54 IC21.18 68.58,55.08 68.58,88.1 | 68.58,88.1 80.01,88.1 80.01,81.75 IC23.16 | 68.58,88.1 44.45,88.1 38.73,82.39 IC22.16
  Bottom 0.254: IC17.29 106.68,46.19 107.31,45.55 115.56,45.55 116.84,46.82 116.84,47.46 116.2,48.09 116.2,64.61 116.84,65.24 123.19,65.24 125.73,67.78 125.73,77.94 82.55,77.94 80.64,79.84 IC23.16
D5  (via drill 0.61)
  Top 0.254: IC22.17 35.55,80.48 v35.55,73.5 35.55,69.05 34.28,67.78 34.28,57.62 33.65,56.98 33.65,26.5 34.28,25.87 IC24.28 | v71.12,74.13 71.12,55.08 IC21.17 | v77.47,74.13 77.47,79.21 IC23.17 | v97.15,44.92 97.79,44.92 97.79,61.43 97.15,62.06 97.15,64.61 96.52,65.24 v96.52,72.86
  Bottom 0.254: v97.15,44.92 97.79,44.92 98.42,44.28 104.77,44.28 IC17.28 | v96.52,72.86 78.73,72.86 v77.47,74.13 v71.12,74.13 62.22,74.13 60.95,72.86 36.19,72.86 v35.55,73.5
D6  (via drill 0.61)
  Top 0.254: v29.84,23.33 30.48,23.96 30.48,42.38 28.57,44.28 28.57,64.61 29.21,65.24 29.21,73.5 33.02,77.3 v33.02,77.94 33.02,80.48 IC22.18 | IC23.18 74.93,79.21 v74.93,77.94 74.93,76.03 73.66,74.77 73.66,55.08 IC21.16 73.66,52.54 v73.66,43.02
  Bottom 0.254: v29.84,23.33 34.28,23.33 IC24.27 | v73.66,43.02 76.2,43.02 76.83,43.65 85.09,43.65 85.72,44.28 86.36,44.28 88.26,42.38 91.44,42.38 92.07,41.74 104.77,41.74 IC17.27 | v33.02,77.94 v74.93,77.94
D7  (via drill 0.61)
  Top 0.254: v26.03,21.42 26.03,43.02 27.3,44.28 27.3,64.61 26.67,65.24 26.67,67.78 28.57,69.69 28.57,74.13 30.48,76.03 30.48,80.48 IC22.19 30.48,83.02 v30.48,86.19 | v76.2,75.4 76.2,55.08 IC21.15 76.2,52.54 v76.2,44.28 | v72.39,75.4 72.39,79.21 IC23.19 72.39,81.75 v72.39,86.19 | v92.07,44.92 v92.07,39.84
  Bottom 0.254: v26.03,21.42 26.67,20.79 34.28,20.79 IC24.26 | v72.39,75.4 v76.2,75.4 | v92.07,39.84 92.7,39.2 104.77,39.2 IC17.26 | v92.07,44.92 88.9,44.92 88.26,45.55 80.64,45.55 79.37,44.28 v76.2,44.28 | v30.48,86.19 31.11,85.56 54.6,85.56 56.51,87.47 67.31,87.47 68.58,86.19 v72.39,86.19
E  (via drill 0.61)
  Top 0.254: v124.45,11.9 125.73,13.17 125.73,66.51 v124.45,67.78 | v40,18.25 40,36.66 43.17,39.84 v43.17,46.19 | v78.73,46.19 78.73,52.54 IC21.14 78.73,55.08 v78.73,67.78
  Bottom 0.254: v124.45,11.9 116.84,11.9 116.2,11.27 IC18.10 | v124.45,67.78 106.68,67.78 106.04,67.14 IC17.37 104.14,66.51 94.61,66.51 93.34,67.78 v78.73,67.78 | v40,18.25 36.82,18.25 IC24.25 | v43.17,46.19 v78.73,46.19
GND  (via drill 0.61)
  Top 0.508: v82.55,74.13 82.55,66.51 IC23.14 | 113.03,57.62 111.76,56.35 IC28.5 | 113.03,57.62 113.03,70.95 C1.1 | 113.03,50 111.76,48.73 IC28.8 | 113.03,50 113.03,57.62 | v101.59,70.32 v101.59,74.13 | v81.28,8.09 81.28,13.17 80.64,13.81 80.64,21.42 80.01,22.06 80.01,25.23 BYP27.2 80.01,26.5 v80.01,30.31 | BYP17.2 105.41,23.96 105.41,25.23 IC17.21 | C6.2 92.7,6.18 92.7,7.46 C4.2 | v95.25,8.09 95.25,10 C5.2 | JP1.1 107.95,4.28 107.95,4.92 IC18.7 | v100.33,5.55 100.33,3.64 C3.2 | v110.48,5.55 110.48,25.23 IC19.8 | 113.03,50 113.03,44.92 114.3,43.65 v114.3,25.87 | IC22.14 40.63,65.24 40.63,62.06 41.9,60.8 41.9,58.25 R13.1 41.9,56.98 v41.9,43.65 | v46.98,66.51 46.98,74.77 BYP23.2 | C7.2 50.79,21.42 50.79,22.7 C11.2 51.43,23.33 52.06,23.96 52.06,29.68 50.79,30.95 50.79,32.22 IC20.15 51.43,34.12 53.34,36.03 53.34,37.3 IC21.1 53.34,39.84 v53.34,43.65 | v55.88,43.65 55.88,52.54 IC21.23 | BYP25.2 10.15,58.25 v10.15,55.08 10.15,31.58 BYP26.2 10.79,30.95 v10.79,33.49 | v6.34,58.89 6.34,76.03 5.71,76.67 BYP22.2 | BYP24.2 20.32,58.25 20.32,56.98 IC24.1 | v20.32,2.38 20.32,4.28 JP3.1 | v27.94,2.38 27.94,4.28 27.3,4.92 v27.3,27.77 | v63.49,30.31 63.49,32.22 IC20.10
  Bottom 0.508: v82.55,74.13 88.9,74.13 IC17.1 91.44,74.13 v101.59,74.13 | BYP28.2 108.58,48.73 109.22,48.73 IC28.8 | C1.1 112.39,71.59 111.12,71.59 C2.2 109.85,71.59 108.58,71.59 107.95,70.95 107.31,70.95 106.68,70.32 v101.59,70.32 | IC27.7 78.73,8.09 v81.28,8.09 82.55,6.82 88.9,6.82 90.17,5.55 92.07,5.55 C6.2 93.34,5.55 v100.33,5.55 104.77,5.55 BYP18.2 106.04,5.55 106.68,5.55 IC18.7 109.22,5.55 v110.48,5.55 | IC17.21 106.68,25.87 107.31,25.87 BYP19.2 108.58,25.87 109.22,25.87 IC19.8 111.76,25.87 v114.3,25.87 | v95.25,8.09 93.34,8.09 C4.2 | v46.98,66.51 41.27,66.51 IC22.14 | BYP20.2 48.89,20.79 50.16,20.79 C7.2 | IC20.10 63.49,34.76 62.86,35.39 51.43,35.39 50.79,34.76 IC20.15 | v55.88,43.65 v53.34,43.65 51.43,43.65 BYP21.2 50.16,43.65 v41.9,43.65 | v10.15,55.08 10.79,54.45 11.42,54.45 12.06,53.81 13.96,53.81 IC25.19 15.87,54.45 17.78,56.35 19.05,56.35 IC24.1 21.59,56.35 26.67,56.35 27.94,57.62 41.27,57.62 R13.1 | v6.34,58.89 9.52,58.89 BYP25.2 | IC26.10 8.25,4.92 10.79,4.92 11.42,4.28 20.32,4.28 JP3.1 | v10.79,33.49 8.88,33.49 IC25.10 6.34,33.49 5.71,33.49 SV9.10 4.44,33.49 3.17,33.49 SV9.9 | 22.22,27.77 21.59,27.14 16.51,27.14 15.87,26.5 IC26.19 | 22.22,27.77 22.22,29.68 10.79,29.68 10.15,30.31 BYP26.2 | v20.32,2.38 v27.94,2.38 | v27.3,27.77 22.22,27.77 | v63.49,30.31 v80.01,30.31
MR
  Top 0.254: IC17.3 90.8,69.69 92.7,71.59 92.7,76.03 R8.1
N$3
  Top 0.254: IC17.39 106.04,72.22 107.31,73.5 107.31,74.13 109.85,76.67 C2.1
  Bottom 0.254: Q1.1 117.47,71.59 116.2,72.86 107.95,72.86 106.68,71.59 IC17.39
N$4
  Top 0.254: IC17.38 106.04,69.69 107.95,71.59 107.95,73.5 109.85,75.4 112.39,75.4 112.39,76.67 C1.2 113.66,76.67 117.47,76.67 Q1.2
N$5
  Bottom 0.254: IC25.2 8.88,53.81 10.15,52.54 17.78,52.54 19.05,53.81 IC24.2
N$6
  Top 0.254: IC18.5 107.31,11.27 107.31,12.54 IC18.4 107.31,13.81 107.31,15.08 IC18.3
N$21
  Top 0.254: IC18.1 106.68,20.79 106.04,20.79 R1.1 105.41,20.15 104.14,18.88 104.14,17.61 100.33,13.81 C3.1
N$22
  Top 0.254: IC18.2 106.68,18.25 106.04,18.25 R2.1 105.41,17.61 104.14,16.34 104.14,4.28 104.77,3.64 JP1.2
N$23  (via drill 0.61)
  Top 0.254: 59.68,37.94 59.05,37.94 IC21.3 | 59.68,37.94 60.32,37.94 IC21.4 | v73.02,19.52 v73.02,13.17 | v59.68,19.52 59.68,37.94
  Bottom 0.254: v73.02,13.17 76.2,13.17 IC27.5 | v73.02,19.52 72.39,20.15 60.32,20.15 v59.68,19.52
N$24
  Top 0.254: IC26.2 8.25,26.5 12.06,30.31 12.06,55.71 13.96,57.62 13.96,59.52 14.6,60.16 22.22,60.16 22.22,35.39 20.95,34.12 IC24.10
N$25  (via drill 0.61)
  Top 0.254: v3.81,7.46 3.81,21.42 4.44,22.06 5.71,22.06 6.34,22.7 6.34,23.33 IC26.3 | v11.42,6.82 v11.42,3.01 | v26.67,3.64 26.67,19.52 22.22,23.96 22.22,30.31 21.59,30.95 IC24.11
  Bottom 0.254: v3.81,7.46 4.44,6.82 v11.42,6.82 | v11.42,3.01 12.06,3.64 v26.67,3.64
N$27
  Top 0.254: IC27.6 76.83,11.27 74.93,13.17 74.93,16.98 R11.A
  Bottom 0.254: IC27.2 76.83,20.15 75.56,18.88 R11.A | C6.1 86.99,5.55 85.72,4.28 80.64,4.28 78.1,6.82 76.2,6.82 75.56,7.46 75.56,10.63 76.2,10.63 IC27.6
N$28
  Top 0.254: IC27.1 78.1,22.7 79.37,21.42 79.37,6.82 78.1,5.55 R9.1
  Bottom 0.254: R9.1 78.1,5.55 80.64,3.01 84.45,3.01 R10.2
N$94  (via drill 0.61)
  Top 0.254: v24.12,23.33 22.86,24.6 22.86,30.95 21.59,32.22 19.05,32.22 18.41,31.58 18.41,29.04 19.05,28.41 IC24.12
  Bottom 0.254: v24.12,23.33 22.86,22.06 12.69,22.06 11.42,20.79 8.88,20.79 IC26.4
N$124  (via drill 0.61)
  Top 0.254: v18.41,19.52 18.41,21.42 19.05,22.06 18.41,22.7 18.41,25.23 19.05,25.87 IC24.13
  Bottom 0.254: v18.41,19.52 8.88,19.52 8.25,18.88 IC26.5
N$125  (via drill 0.61)
  Top 0.254: v22.22,14.44 22.22,22.7 21.59,23.33 IC24.14
  Bottom 0.254: v22.22,14.44 13.96,14.44 13.33,15.08 10.79,15.08 10.15,15.71 8.88,15.71 IC26.6
N$126
  Bottom 0.254: IC26.7 8.88,13.17 10.15,11.9 22.86,11.9 26.67,15.71 26.67,19.52 22.86,19.52 21.59,20.79 IC24.15
N$127  (via drill 0.61)
  Top 0.254: v11.42,10.63 v11.42,16.98
  Bottom 0.254: v11.42,10.63 8.88,10.63 IC26.8 | v11.42,16.98 16.51,16.98 17.78,18.25 19.05,18.25 IC24.16
N$128  (via drill 0.61)
  Top 0.254: v25.39,9.36 v25.39,15.71
  Bottom 0.254: v25.39,9.36 8.88,9.36 8.25,8.73 IC26.9 | v25.39,15.71 21.59,15.71 IC24.17
N$129
  Bottom 0.254: IC25.3 8.88,51.27 10.15,50 17.78,50 19.05,51.27 IC24.3
N$130
  Bottom 0.254: IC25.4 8.88,48.73 9.52,48.09 13.33,48.09 13.96,47.46 17.78,47.46 19.05,48.73 IC24.4
N$131
  Bottom 0.254: IC25.5 8.88,46.19 9.52,45.55 13.33,45.55 13.96,44.92 17.78,44.92 19.05,46.19 IC24.5
N$132
  Bottom 0.254: IC25.6 8.88,43.65 10.15,42.38 17.78,42.38 19.05,43.65 IC24.6
N$133
  Bottom 0.254: IC25.7 8.88,41.11 9.52,40.48 13.33,40.48 13.96,39.84 17.78,39.84 19.05,41.11 IC24.7
N$134
  Bottom 0.254: IC25.8 8.88,38.57 9.52,37.94 13.33,37.94 13.96,37.3 17.78,37.3 19.05,38.57 IC24.8
N$135
  Bottom 0.254: IC25.9 8.88,36.03 9.52,35.39 13.33,35.39 13.96,34.76 17.78,34.76 19.05,36.03 IC24.9
N$136  (via drill 0.61)
  Top 0.254: v8.88,63.97 8.88,58.25 9.52,57.62 9.52,55.71 8.88,55.08 9.52,54.45 9.52,32.22 8.88,31.58 8.88,28.41 IC26.1 | v31.75,63.34 32.38,62.7 32.38,39.84 31.11,38.57 v31.11,11.9
  Bottom 0.254: v8.88,63.97 10.15,63.97 10.79,63.34 v31.75,63.34 | v31.11,11.9 29.84,10.63 21.59,10.63 IC24.19
N$137  (via drill 0.61)
  Top 0.254: v11.42,56.35 v11.42,61.43 | v23.49,61.43 v23.49,53.81
  Bottom 0.254: v11.42,56.35 8.88,56.35 IC25.1 | v11.42,61.43 12.06,62.06 22.86,62.06 v23.49,61.43 | v23.49,53.81 34.28,53.81 IC24.39
N$138
  Bottom 0.254: IC24.40 36.19,55.71 37.46,54.45 37.46,52.54 27.94,52.54 26.03,50.63 26.03,29.04 27.3,29.04 28.57,27.77 28.57,22.7 26.03,22.7 24.76,21.42 24.76,20.15 27.3,20.15 33.65,13.81 33.65,11.9 40,11.9 40.63,11.27 69.84,11.27 73.02,14.44 80.01,14.44 83.81,10.63 IC27.9
N$140
  Top 0.254: IC27.8 86.36,8.09 86.99,8.09 C4.1 87.62,8.73 88.9,10 88.9,14.44 85.72,17.61 IC27.12
  Bottom 0.254: R4.1 92.07,10.63 89.53,8.09 88.26,8.09 C4.1
N$141
  Top 0.254: R3.1 90.8,18.25 92.07,18.25 R4.2
  Bottom 0.254: IC27.13 86.36,20.79 87.62,19.52 88.26,19.52 89.53,18.25 R3.1
N$142
  Bottom 0.254: IC27.11 86.36,15.71 94.61,15.71 C5.1
N$143
  Top 0.254: R10.1 76.83,3.01 75.56,4.28 75.56,4.92 R11.E
N$144
  Bottom 0.254: X1.4 52.06,15.08 52.7,14.44 57.78,14.44 58.41,13.81 X1.6
N$145
  Top 0.254: X1.8 53.97,13.17 55.24,13.17 X1.7
N$146
  Top 0.254: X1.5 48.89,15.08 44.45,15.08 X1.G2
  Bottom 0.254: X1.G1 64.77,15.08 62.86,16.98 50.16,16.98 49.52,16.34 X1.5
N$147
  Top 0.254: IC18.12 114.93,16.34 114.93,17.61 IC18.13
  Bottom 0.254: IC21.5 62.86,37.94 61.59,36.66 45.08,36.66 41.9,33.49 41.9,32.22 44.45,29.68 44.45,19.52 58.41,19.52 59.68,20.79 74.93,20.79 76.2,22.06 110.48,22.06 114.3,18.25 IC18.13
N$148
  Top 0.254: LED1.K 118.11,11.27 116.84,12.54 116.84,13.17 IC18.11
N$149
  Bottom 0.254: R12.1 88.26,18.25 89.53,16.98 120.65,16.98 125.73,11.9 125.73,10.63 121.28,10.63 LED1.A
N$150
  Top 0.254: IC21.24 53.34,55.08 53.34,56.35 JP2.1
  Bottom 0.254: R13.2 50.16,57.62 52.7,57.62 JP2.1
N$151
  Top 0.254: IC18.8 116.2,6.18 119.38,9.36 119.38,24.6 120.01,25.23 120.01,44.28 116.2,48.09 116.2,64.61 116.84,65.24 114.3,67.78 114.3,72.22 113.66,72.86 108.58,72.86 108.58,60.8 109.85,59.52 IC28.4
N$152
  Bottom 0.254: IC19.5 111.12,34.12 114.3,37.3 114.3,44.92 116.84,44.92 120.01,48.09 120.01,63.34 118.74,63.34 IC28.15
N$153
  Top 0.254: IC20.7 64.13,25.23 65.4,25.23 IC20.8
N$154
  Top 0.254: C7.1 55.88,20.15 55.88,15.08 56.51,14.44 64.13,14.44 64.13,16.34 65.4,17.61 71.75,17.61 71.75,19.52 73.02,20.79 75.56,20.79 75.56,20.15 76.83,18.88 IC27.3
N$155
  Top 0.254: IC20.5 58.41,24.6 58.41,19.52 59.68,18.25 67.31,18.25 67.31,31.58 68.58,32.85 C9.2
N$156
  Bottom 0.254: IC20.4 56.51,26.5 58.41,28.41 67.94,28.41 C9.1
N$157
  Bottom 0.254: C8.2 45.71,30.31 45.71,27.77 51.43,27.77 52.7,26.5 IC20.3
N$158
  Top 0.254: C8.1 46.35,25.87 47.62,25.87 IC20.1
N$159
  Bottom 0.254: C11.1 56.51,23.33 57.14,23.96 59.05,23.96 60.32,25.23 IC20.6
N$160
  Bottom 0.254: C10.2 48.89,23.33 50.16,24.6 50.79,24.6 IC20.2
PIA-A0  (via drill 0.61)
  Top 0.254: v2.54,52.54 2.54,44.28 SV9.1
  Bottom 0.254: v2.54,52.54 8.88,52.54 9.52,51.91 11.42,51.91 12.06,51.27 13.96,51.27 IC25.18
PIA-A1  (via drill 0.61)
  Top 0.254: v5.08,50 5.08,44.28 SV9.2
  Bottom 0.254: v5.08,50 8.88,50 9.52,49.37 11.42,49.37 12.06,48.73 13.96,48.73 IC25.17
PIA-A2
  Bottom 0.254: IC25.16 13.96,46.19 12.69,47.46 4.44,47.46 1.27,44.28 1.27,41.74 2.54,41.74 SV9.3
PIA-A3
  Bottom 0.254: IC25.15 13.96,43.65 12.69,44.92 4.44,44.92 3.81,44.28 3.81,41.74 5.08,41.74 SV9.4
PIA-A4  (via drill 0.61)
  Top 0.254: v13.33,32.22 13.33,40.48 13.96,41.11 IC25.14 | v3.81,32.22 3.81,36.66 3.17,37.3 3.17,38.57 SV9.5
  Bottom 0.254: v3.81,32.22 v13.33,32.22
PIA-A5
  Bottom 0.254: IC25.13 13.96,38.57 12.69,39.84 5.71,39.84 5.08,39.2 SV9.6
PIA-A6
  Bottom 0.254: IC25.12 13.96,36.03 12.69,37.3 4.44,37.3 3.17,36.03 SV9.7
PIA-A7
  Bottom 0.254: IC25.11 13.96,33.49 12.69,34.76 5.71,34.76 5.08,35.39 SV9.8
PIA-B0
  Bottom 0.254: IC26.18 13.96,23.33 12.69,24.6 4.44,24.6 3.81,25.23 3.81,27.77 2.54,27.77 SV9.13
PIA-B1  (via drill 0.61)
  Top 0.254: v13.33,27.14 13.33,21.42 13.96,20.79 IC26.17
  Bottom 0.254: v13.33,27.14 5.71,27.14 5.08,27.77 SV9.14
PIA-B2  (via drill 0.61)
  Top 0.254: v17.78,57.62 17.78,31.58 17.14,30.95 17.14,18.88 16.51,18.25 IC26.16 | v2.54,57.62 1.27,56.35 1.27,40.48 1.9,39.84 v3.81,39.84
  Bottom 0.254: v2.54,57.62 v17.78,57.62 | v3.81,39.84 1.9,39.84 1.27,39.2 1.27,25.87 1.9,25.87 SV9.15
PIA-B3  (via drill 0.61)
  Top 0.254: v2.54,16.98 1.27,18.25 1.27,22.06 3.17,22.06 3.81,22.7 3.81,23.96 4.44,24.6 4.44,25.87 SV9.16
  Bottom 0.254: v2.54,16.98 8.88,16.98 9.52,16.34 10.79,16.34 11.42,15.71 13.96,15.71 IC26.15
PIA-B4
  Bottom 0.254: IC26.14 13.96,13.17 12.69,14.44 3.81,14.44 1.27,16.98 1.27,23.33 1.9,23.33 SV9.17
PIA-B5  (via drill 0.61)
  Top 0.254: v12.69,10.63 11.42,9.36 10.79,9.36 10.79,10 10.15,10.63 10.79,11.27 10.79,16.34 10.15,16.98 10.15,18.25 10.79,18.88 v10.79,22.06
  Bottom 0.254: v12.69,10.63 13.96,10.63 IC26.13 | v10.79,22.06 6.34,22.06 5.71,22.7 5.08,22.7 SV9.18
PIA-B6  (via drill 0.61)
  Top 0.254: v10.15,8.09 10.15,9.36 9.52,10 9.52,11.27 8.88,11.9 5.08,11.9 5.08,13.81 4.44,14.44 4.44,15.08 5.08,15.71 v5.08,18.25 | v2.54,18.25 2.54,20.15 SV9.19
  Bottom 0.254: v10.15,8.09 13.96,8.09 IC26.12 | v5.08,18.25 v2.54,18.25
PIA-B7
  Top 0.254: IC26.11 14.6,6.18 13.33,7.46 13.33,8.73 13.96,9.36 17.14,9.36 17.14,11.27 16.51,11.9 12.69,11.9 12.69,21.42 10.79,23.33 9.52,23.33 9.52,20.15 8.88,19.52 5.08,19.52 5.08,20.15 SV9.20
R/!W  (via drill 0.61)
  Top 0.254: v81.28,41.74 81.28,52.54 IC21.13 81.28,55.08 v81.28,57.62 | IC24.21 36.82,8.09 36.82,9.36 38.09,10.63 38.09,19.52 39.36,20.79 v39.36,41.11 38.73,41.74 38.73,64.61 39.36,65.24 v39.36,69.69 | v10.15,69.05 10.15,80.48 IC22.27
  Bottom 0.254: v39.36,41.11 80.64,41.11 v81.28,41.74 | v10.15,69.05 38.73,69.05 v39.36,69.69 | v81.28,57.62 91.44,57.62 92.7,58.89 104.14,58.89 IC17.34
RX
  Top 0.254: IC20.12 58.41,34.76 55.88,37.3 IC21.2
RXD
  Top 0.254: IC20.13 55.88,32.22 57.14,30.95 57.14,16.34 X1.2
TX
  Bottom 0.254: IC20.11 60.32,32.85 59.05,31.58 50.16,31.58 49.52,32.22 49.52,36.03 63.49,36.03 65.4,37.94 IC21.6
TXD
  Top 0.254: IC20.14 53.34,32.22 54.6,30.95 54.6,16.34 X1.3
VCC  (via drill 0.61)
  Top 0.508: BYP20.1 43.17,21.42 43.17,22.7 C10.1 43.17,23.96 v43.17,33.49 | v48.25,38.57 48.25,34.76 IC20.16 | v17.78,8.09 17.78,6.18 R14.2 | 37.46,15.08 37.46,11.27 36.82,10.63 IC24.22 | 37.46,15.08 36.82,15.71 IC24.24 | v38.09,20.79 37.46,20.15 37.46,15.08 | v97.79,10.63 97.79,17.61 R2.2 97.79,18.88 97.79,20.15 R1.2 97.79,21.42 v97.79,23.33 | IC27.14 85.09,23.96 85.09,25.23 BYP27.1 85.09,26.5 v85.09,38.57 | v82.55,5.55 v82.55,13.17 81.91,13.81 v81.91,15.71 v81.91,23.33 | v87.62,13.17 87.62,11.27 R12.2 | IC26.20 15.23,29.04 15.23,30.31 BYP26.1 15.87,30.95 17.14,32.22 17.14,55.71 16.51,56.35 IC25.20 15.23,56.98 15.23,58.25 BYP25.1 | IC22.28 7.62,80.48 7.62,67.78 IC22.1 7.62,65.24 v7.62,60.16 | IC23.28 49.52,79.21 49.52,66.51 IC23.1 49.52,63.97 v49.52,61.43 | R7.2 52.06,82.39 52.06,81.75 IC23.27 | v55.88,61.43 55.88,58.89 JP2.2 | IC18.14 115.56,21.42 v115.56,29.68 v115.56,43.65 114.3,44.92 v114.3,53.81 v114.3,66.51 | v87.62,56.35 87.62,54.45 R6.2 87.62,53.17 v87.62,39.84 | R5.2 100.33,78.58 100.33,77.3 R8.2 100.33,76.03 v100.33,63.97 v100.33,56.35 | IC17.36 105.41,63.34 105.41,62.06 IC17.35 106.68,61.43 107.95,60.16 107.95,54.45 BYP28.1 | v25.39,61.43 25.39,59.52 BYP24.1
  Bottom 0.508: v48.25,38.57 50.16,38.57 BYP21.1 50.79,39.2 52.06,40.48 71.75,40.48 | v43.17,33.49 47.62,33.49 IC20.16 | v17.78,8.09 19.05,8.09 IC24.20 21.59,8.09 28.57,8.09 31.11,10.63 34.28,10.63 IC24.22 | v38.09,20.79 42.54,20.79 BYP20.1 | v97.79,10.63 104.77,10.63 BYP18.1 | BYP17.1 99.69,23.33 v97.79,23.33 86.36,23.33 IC27.14 83.81,23.33 v81.91,23.33 | 71.75,40.48 71.12,39.84 IC21.8 | 71.75,40.48 75.56,40.48 | 75.56,40.48 76.2,39.84 IC21.10 | 81.28,39.84 80.64,40.48 75.56,40.48 | 81.28,39.84 IC21.12 | R12.2 88.26,10.63 89.53,10.63 R3.2 | v82.55,5.55 84.45,5.55 R9.2 | v82.55,13.17 83.81,13.17 IC27.10 86.36,13.17 v87.62,13.17 | v81.91,15.71 78.73,15.71 IC27.4 | v85.09,38.57 81.91,38.57 IC21.12 | SV9.11 3.17,30.95 4.44,30.95 SV9.12 5.71,30.95 6.34,30.95 6.98,30.31 8.88,30.31 10.79,28.41 13.96,28.41 IC26.20 | BYP24.1 25.39,59.52 24.76,60.16 18.41,60.16 17.14,58.89 15.87,58.89 BYP25.1 15.23,59.52 14.6,60.16 v7.62,60.16 | BYP22.1 5.71,81.75 6.98,81.75 IC22.28 | BYP23.1 47.62,80.48 48.89,80.48 IC23.28 50.16,80.48 51.43,80.48 IC23.27 | v55.88,61.43 v49.52,61.43 v25.39,61.43 | v115.56,43.65 116.84,43.65 IC19.16 | v115.56,29.68 108.58,29.68 107.95,30.31 BYP19.1 | BYP28.1 108.58,53.81 109.22,53.81 IC28.6 111.76,53.81 v114.3,53.81 | v114.3,66.51 116.84,66.51 IC28.16 | v100.33,63.97 104.14,63.97 IC17.36 | v100.33,56.35 91.44,56.35 IC17.8 88.9,56.35 v87.62,56.35 55.88,56.35 JP2.2 | 81.28,39.84 v87.62,39.84 | 81.28,39.84 IC21.12
VMA  (via drill 0.61)
  Top 0.254: v112.39,8.09 111.76,8.73 111.76,23.33 v112.39,23.96 | v96.52,24.6 96.52,33.49 95.25,34.76 95.25,60.16 v95.88,60.8
  Bottom 0.254: v112.39,8.09 114.3,8.09 IC18.9 | v112.39,23.96 106.68,23.96 106.04,24.6 v96.52,24.6 | v95.88,60.8 92.7,63.97 91.44,63.97 IC17.5